# EAGLE design master_muhsin_v1 (EAGLE 7.1.0)
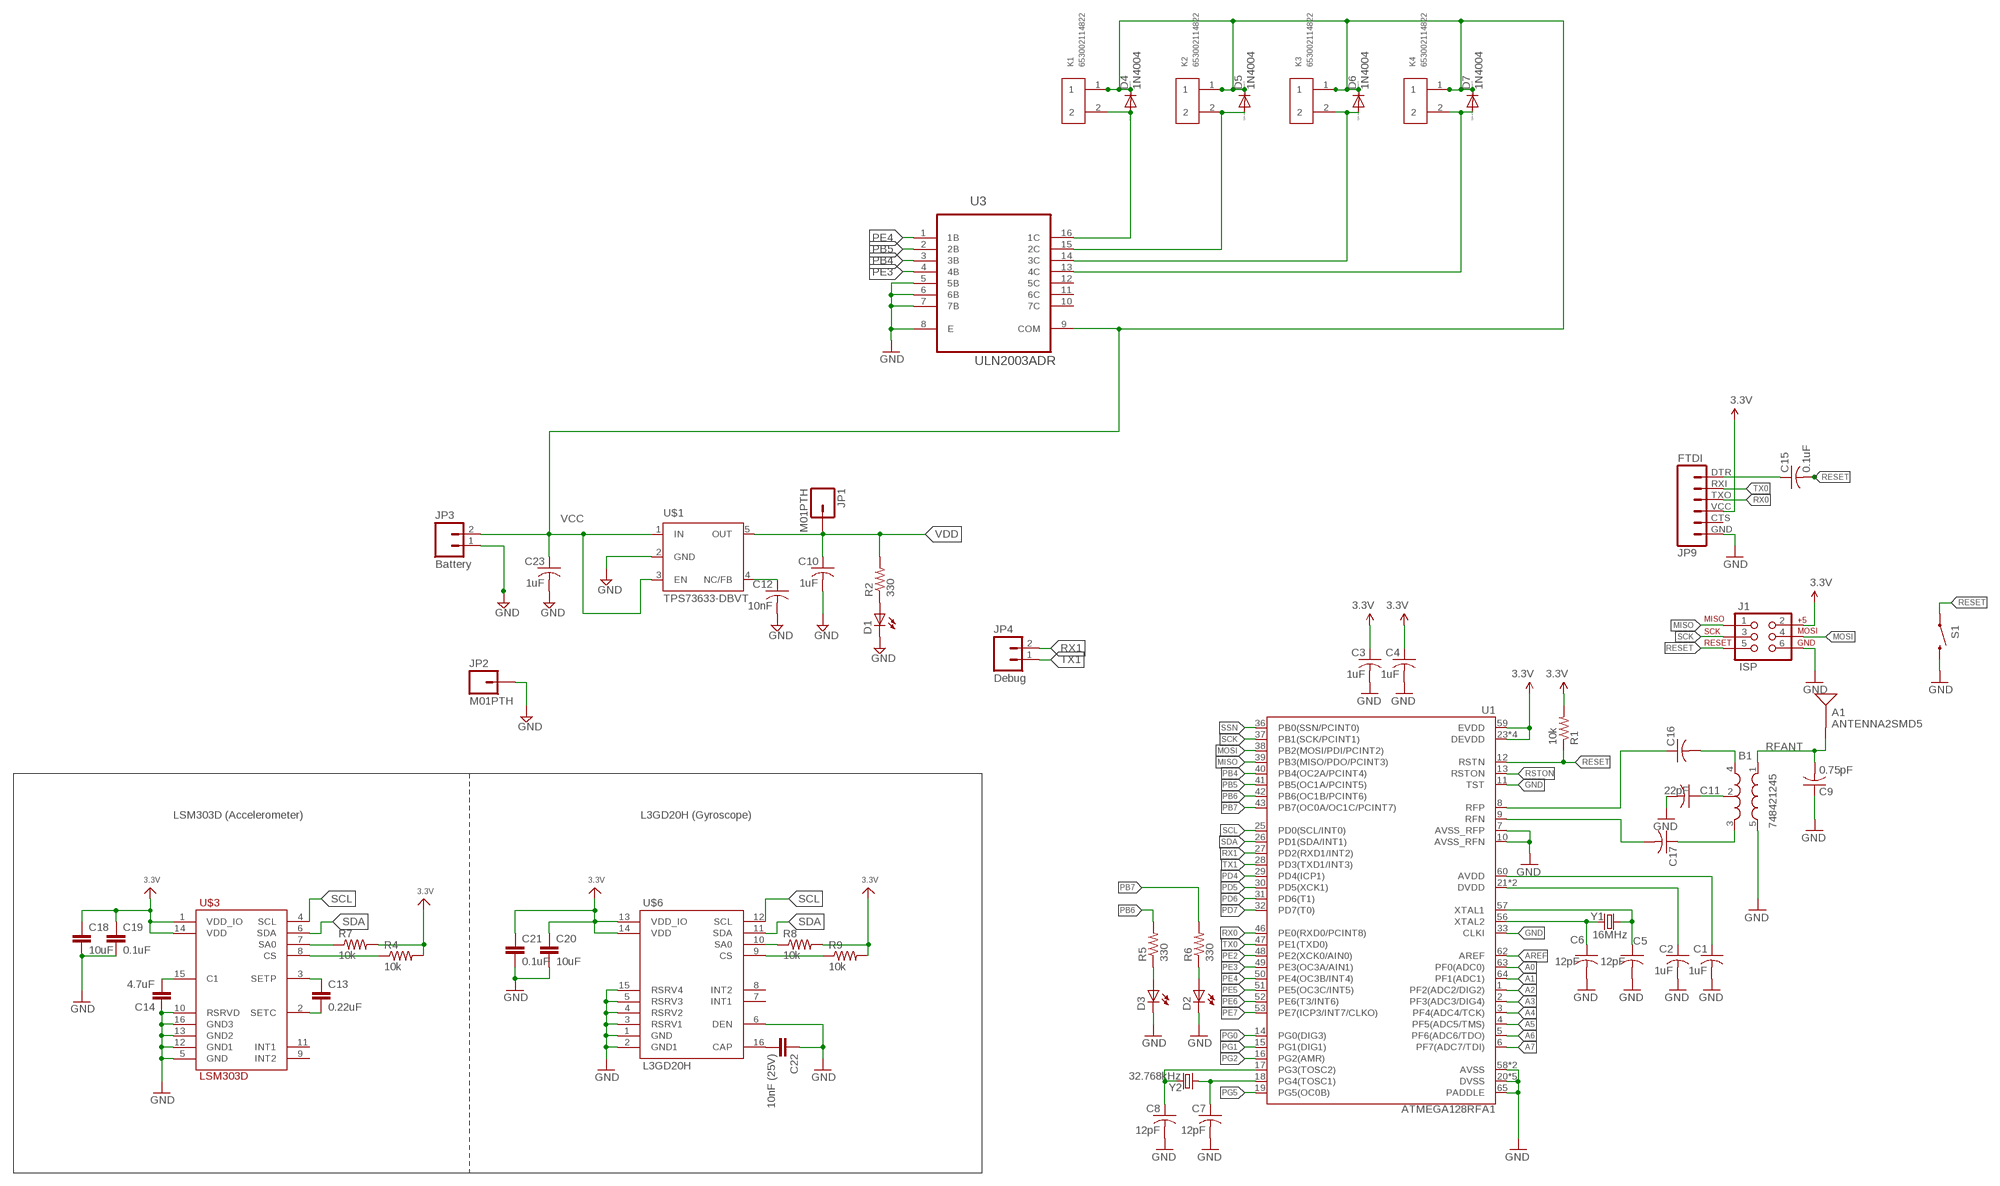
[diagram p0: schematic, sheet 1]

## Parts
A1  ANTENNA2SMD5  [ANTENNA-CHIP5]
B1  748421245  BALUN0805  [BALUN]
C1  1uF  C-USC0805  [C0805]
C2  1uF  C-USC0805  [C0805]
C3  1uF  C-USC0805  [C0805]
C4  1uF  C-USC0805  [C0805]
C5  12pF  C-USC0805  [C0805]
C6  12pF  C-USC0805  [C0805]
C7  12pF  C-USC0805  [C0805]
C8  12pF  C-USC0805  [C0805]
C9  0.75pF  C-USC0805  [C0805]
C10  1uF  C-USC0805  [C0805]
C11  22pF  C-USC0805  [C0805]
C12  10nF  C-USC0805  [C0805]
C13  0.22uF  CAP0805  [0805]
C14  4.7uF  CAP0805  [0805]
C15  0.1uF  C-USC0805  [C0805]
C16  C-USC0805  [C0805]
C17  C-USC0805  [C0805]
C18  10uF  CAP0805  [0805]
C19  0.1uF  CAP0805  [0805]
C20  10uF  CAP0805  [0805]
C21  0.1uF  CAP0805  [0805]
C22  10nF (25V)  CAP0805  [0805]
C23  1uF  C-USC0805  [C0805]
D1  LED5MM  [LED5MM]
D2  LED5MM  [LED5MM]
D3  LED5MM  [LED5MM]
D4  1N4004  [DO41-10]
D5  1N4004  [DO41-10]
D6  1N4004  [DO41-10]
D7  1N4004  [DO41-10]
J1  ISP  AVR_SPI_PRG_6NS  [2X3-NS]
JP1  M01PTH  [1X01]
JP2  M01PTH  [1X01]
JP3  Battery  M02PTH  [1X02]
JP4  Debug  M02PTH  [1X02]
JP9  FTDI  FTDI_BASICPTH  [FTDI_BASIC]
K1  653002114822  [653002114822]
K2  653002114822  [653002114822]
K3  653002114822  [653002114822]
K4  653002114822  [653002114822]
R1  10k  R-US_R0805  [R0805]
R2  330  R-US_R0805  [R0805]
R4  10k  RESISTOR0805-RES  [0805]
R5  330  R-US_R0805  [R0805]
R6  330  R-US_R0805  [R0805]
R7  10k  RESISTOR0805-RES  [0805]
R8  10k  RESISTOR0805-RES  [0805]
R9  10k  RESISTOR0805-RES  [0805]
S1  SWITCH-MOMENTARY-2SMD  [TACTILE_SWITCH_SMD]
U1  ATMEGA128RFA1  [QFN-64]
U3  ULN2003ADR  [SOIC127P600X175-16N]
U$1  TPS73633-DBVT  [SOT23-DBV]
U$3  LSM303D  [LGA16_3X3MM]
U$6  L3GD20H  [LGA16_3X3MM]
Y1  16MHz  CRYSTAL5X3  [CRYSTAL-SMD-5X3]
Y2  32.768kHz  CRYSTAL32-SMD  [CRYSTAL-32KHZ-SMD]

## Nets
3.3V: C3.1 C4.1 C18.1 C19.1 C20.1 C21.1 J1.2 JP9.VCC R1.2 R4.2 R7.2 R8.2 R9.2 U1.23(DEVDD) U1.34(DEVDD) U1.44(DEVDD) U1.54(DEVDD) U1.59(EVDD) U$3.1(VDD_IO) U$3.14(VDD) U$6.13(VDD_IO) U$6.14(VDD)
A0: U1.63(PF0(ADC0))
A1: U1.64(PF1(ADC1))
A2: U1.1(PF2(ADC2/DIG2))
A3: U1.2(PF3(ADC3/DIG4))
A4: U1.3(PF4(ADC4/TCK))
A5: U1.4(PF5(ADC5/TMS))
A6: U1.5(PF6(ADC6/TDO))
A7: U1.6(PF7(ADC7/TDI))
AREF: U1.62(AREF)
AVDD: C1.1 U1.60(AVDD)
DTR: C15.1 JP9.DTR
DVDD: C2.1 U1.21(DVDD) U1.22(DVDD)
GND: B1.5(GND) C1.2 C2.2 C3.2 C4.2 C5.2 C6.2 C7.2 C8.2 C9.1 C10.2 C11.2 C12.2 C14.1 C18.2 C19.2 C20.2 C21.2 C22.1 C23.2 D1.K(C) D2.K(C) D3.K(C) J1.6 JP2.1 JP3.1 JP9.GND S1.3 U1.7(AVSS_RFP) U1.10(AVSS_RFN) U1.11(TST) U1.20(DVSS) U1.24(DVSS) U1.33(CLKI) U1.35(DVSS) U1.45(DVSS) U1.55(DVSS) U1.58(AVSS) U1.61(AVSS) U1.65(PADDLE) U3.5(5B) U3.6(6B) U3.7(7B) U3.8(E) U$1.2(GND) U$3.5(GND) U$3.10(RSRVD) U$3.12(GND1) U$3.13(GND2) U$3.16(GND3) U$6.1(GND) U$6.2(GND1) U$6.3(RSRV1) U$6.4(RSRV2) U$6.5(RSRV3) U$6.6(DEN) U$6.15(RSRV4)
MISO: J1.1 U1.39(PB3(MISO/PDO/PCINT3))
MOSI: J1.4 U1.38(PB2(MOSI/PDI/PCINT2))
N$1: C12.1 U$1.4(NC/FB)
N$2: D1.A R2.1
N$3: C5.1 U1.57(XTAL1) Y1.3
N$4: C6.1 U1.56(XTAL2) Y1.1
N$5: C7.1 U1.18(PG4(TOSC1)) Y2.X1
N$6: C8.1 U1.17(PG3(TOSC2)) Y2.X2
N$7: B1.2(GND) C11.1
N$8: D3.A R5.1
N$9: C13.1 U$3.3(SETP)
N$10: B1.4(OUT1) C16.2
N$11: B1.3(OUT2) C17.1
N$12: C13.2 U$3.2(SETC)
N$13: D2.A R6.1
N$14: R4.1 U$3.8(CS)
N$15: R7.1 U$3.7(SA0)
N$16: C14.2 U$3.15(C1)
N$17: R8.1 U$6.10(SA0)
N$18: R9.1 U$6.9(CS)
N$19: C22.2 U$6.16(CAP)
N$29: D4.A K1.2 U3.16(1C)
N$30: D5.A K2.2 U3.15(2C)
N$31: D6.A K3.2 U3.14(3C)
N$32: D7.A K4.2 U3.13(4C)
PB4: U1.40(PB4(OC2A/PCINT4)) U3.3(3B)
PB5: U1.41(PB5(OC1A/PCINT5)) U3.2(2B)
PB6: R5.2 U1.42(PB6(OC1B/PCINT6))
PB7: R6.2 U1.43(PB7(OC0A/OC1C/PCINT7))
PD4: U1.29(PD4(ICP1))
PD5: U1.30(PD5(XCK1))
PD6: U1.31(PD6(T1))
PD7: U1.32(PD7(T0))
PE2: U1.48(PE2(XCK0/AIN0))
PE3: U1.49(PE3(OC3A/AIN1)) U3.4(4B)
PE4: U1.50(PE4(OC3B/INT4)) U3.1(1B)
PE5: U1.51(PE5(OC3C/INT5))
PE6: U1.52(PE6(T3/INT6))
PE7: U1.53(PE7(ICP3/INT7/CLKO))
PG0: U1.14(PG0(DIG3))
PG1: U1.15(PG1(DIG1))
PG2: U1.16(PG2(AMR))
PG5: U1.19(PG5(OC0B))
RESET: C15.2 J1.5 R1.1 S1.1 U1.12(RSTN)
RFANT [RFSIG]: A1.FEED(SIGNAL) B1.1(IN) C9.2
RFN: C17.2 U1.9(RFN)
RFP: C16.1 U1.8(RFP)
RSTON: U1.13(RSTON)
RX0: JP9.TXO U1.46(PE0(RXD0/PCINT8))
RX1: JP4.2 U1.27(PD2(RXD1/INT2))
SCK: J1.3 U1.37(PB1(SCK/PCINT1))
SCL: U1.25(PD0(SCL/INT0)) U$3.4(SCL) U$6.12(SCL)
SDA: U1.26(PD1(SDA/INT1)) U$3.6(SDA) U$6.11(SDA)
SSN: U1.36(PB0(SSN/PCINT0))
TX0: JP9.RXI U1.47(PE1(TXD0))
TX1: JP4.1 U1.28(PD3(TXD1/INT3))
VCC: C23.1 D4.C D5.C D6.C D7.C JP3.2 K1.1 K2.1 K3.1 K4.1 U3.9(COM) U$1.1(IN) U$1.3(EN)
VDD: C10.1 JP1.1 R2.2 U$1.5(OUT)
Unconnected: JP9.CTS U3.10(7C) U3.11(6C) U3.12(5C) U$3.9(INT2) U$3.11(INT1) U$6.7(INT1) U$6.8(INT2)

## Notes on the sheet
- LSM303D (Accelerometer) | L3GD20H (Gyroscope)

## Library data of the parts
A1 = SparkFun-RF:ANTENNA2: Chip antenna Single endded antenna. Common with smaller chip antennas. CHIP4 package is the GPS Chip Antenna SKU: GPS-08418. CHIP5 package is 2.4GHz chip antenna SKU: WRL-00144.
B1 = SparkFun-RF:BALUN: 0805 footprint balun- Ember 351/357
C1-C12 C15-C17 C23 = resistor:C-US: CAPACITOR, American symbol
C13 C14 C18-C22 = SparkFun-Capacitors:CAP: Capacitor Standard 0603 ceramic capacitor, and 0.1" leaded capacitor.
D1-D3 = Components:LED: LED OSRAM: - CHIPLED LG R971, LG N971, LY N971, LG Q971, LY Q971, LO R971, LY R971 LH N974, LH R974 LS Q976, LO Q976, LY Q976 LO Q996 - Hyper CHIPLED LW Q18S LB Q993, LB Q99A, LB R99A - SideLED LS A670, LO A670, LY A670, LG A670, LP A670 LB A673, LV A673, LT A673, LW A673 LH A674 LY A675 LS A676, LA A676, LO A676, LY A676, LW A676 LS A679, LY A679, LG A679 - Hyper Micro SIDELED® LS Y876, LA Y876, LO Y876, LY Y876 LT Y87S - SmartLED LW L88C, LW L88S LB L89C, LB L89S, LG L890 LS L89K, LO L89K, LY L89K LS L896, LA L896, LO L896, LY L896 - TOPLED LS T670, LO T670, LY T670, LG T670, LP T670 LSG T670, LSP T670, LSY T670, LOP T670, LYG T670 LG T671, LOG T671, LSG T671 LB T673, LV T673, LT T673, LW T673 LH T674 LS T676, LA T676, LO T676, LY T676, LB T676, LH T676, LSB T676, LW T676 LB T67C, LV T67C, LT T67C, LS T67K, LO T67K, LY T67K, LW E67C LS E67B, LA E67B, LO E67B, LY E67B, LB E67C, LV E67C, LT E67C LW T67C LS T679, LY T679, LG T679 LS T770, LO T770, LY T770, LG T770, LP T770 LB T773, LV T773, LT T773, LW T773 LH T774 LS E675, LA E675, LY E675, LS T675 LS T776, LA T776, LO T776, LY T776, LB T776 LHGB T686 LT T68C, LB T68C - Hyper Mini TOPLED® LB M676 - Mini TOPLED Santana® LG M470 LS M47K, LO M47K, LY M47K Source: http://www.osram.convergy.de/
D4-D7 = diode:1N4004: DIODE general purpose rectifier, 1 A; MF: NTE ELECTRONICS; MPN: 1N4004; OC_FARNELL: 2295710
J1 = SparkFun-Connectors:AVR_SPI_PRG_6: AVR ISP 6 Pin This is the reduced ISP connector for AVR programming. Common on Arduino. This footprint will take up less PCB space and can be used with a 10-pin to 6-pin adapter such as SKU: BOB-08508
JP1 JP2 = SparkFun:M01: Header 1 Standard 1-pin 0.1" header. Use with straight break away headers (SKU : PRT-00116), right angle break away headers (PRT-00553), swiss pins (PRT-00743), machine pins (PRT-00117), and female headers (PRT-00115).
JP3 JP4 = SparkFun:M02: Header 2 Standard 2-pin 0.1" header. Use with straight break away headers (SKU : PRT-00116), right angle break away headers (PRT-00553), swiss pins (PRT-00743), machine pins (PRT-00117), and female headers (PRT-00115). Molex polarized connector foot print use with SKU : PRT-08233 with associated crimp pins and housings.
JP9 = SparkFun-Connectors:FTDI_BASIC: FTDI Basic header with labels
K1-K4 = Wuerth_Elektronik_eiCan_Wire_to_Board_Connectors:653002114822: WR-WTB 1.25mm Male Vertical Shrouded Header, 2 Pins=>Code : Con_WTB_1.25_PCB_THT_653002114822 <http://katalog.we-online.de/media/thumbs2/eican/thb_Con_WTB_1.25_PCB_THT_6530xx114822_pf2.jpg> Details see: http://katalog.we-online.de/en/em/653_0xx_114_822 Created 2014-06-06, Karrer Zheng 2014 (C) Würth Elektronik; OC_FARNELL: unknown
R1 R2 R5 R6 = resistor:R-US_: RESISTOR, American symbol
R4 R7-R9 = SparkFun-Passives:RESISTOR: Resistor Basic schematic elements and footprints for 0603, 1206, and PTH resistors.
S1 = SparkFun-Electromechanical:SWITCH-MOMENTARY-2: Various NO switches- pushbuttons, reed, etc
U1 = SparkFun-DigitalIC:ATMEGA128RFA1: ATmega128RFA1 8-bit AVR Microcontroller with Low Power 2.4GHz Transceiver for ZigBee and IEEE 802.15.4
U3 = Texas Instruments_By_element14_Batch_1:ULN2003ADR: 8-BIT SHIFT REGISTERS WITH 3-STATE OUTPUT REGISTERS; MPN: ULN2003ADR; OC_FARNELL: 1470513; OC_NEWARK: 77C3560; PACKAGE: SOIC-16; SUPPLIER: TEXAS INSTRUMENTS
U$1 = Power:TPS73633-DBVT
U$3 = IMU_parts:LSM303D
U$6 = IMU_parts:L3GD20H
Y1 Y2 = SparkFun-FreqCtrl:CRYSTAL: Various standard crystals. Proven footprints. Spark Fun Electronics SKU : COM-00534

## Net classes
1 RFSIG: width 0.457 mm, clearance 0.205 mm to class 0, clearance 0.205 mm

## Board
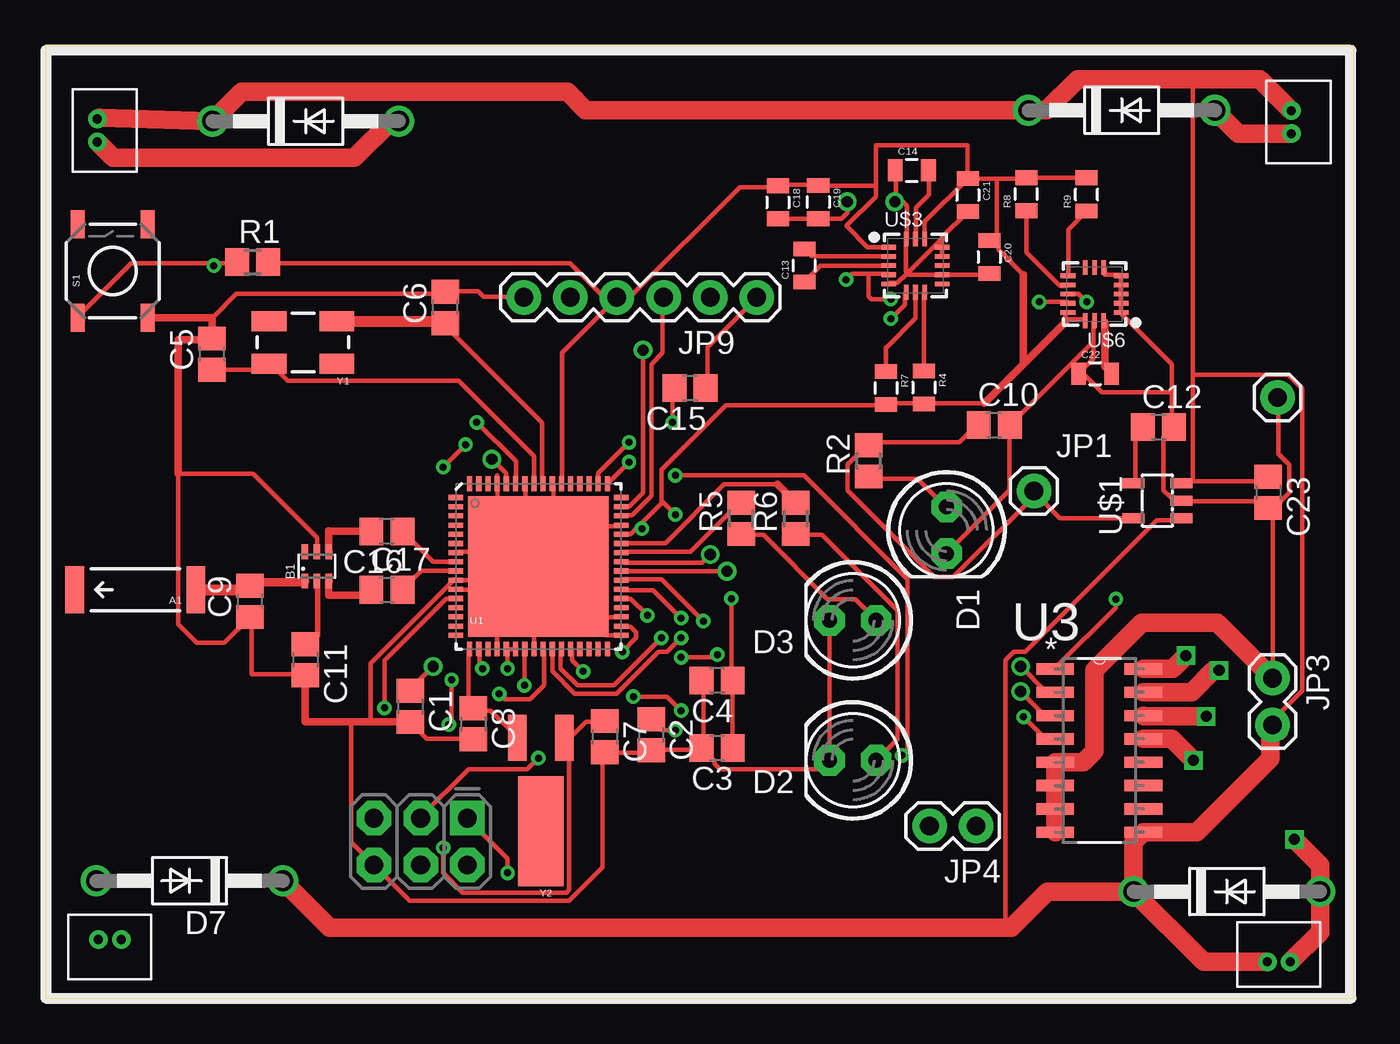
[diagram p1: board, top side]
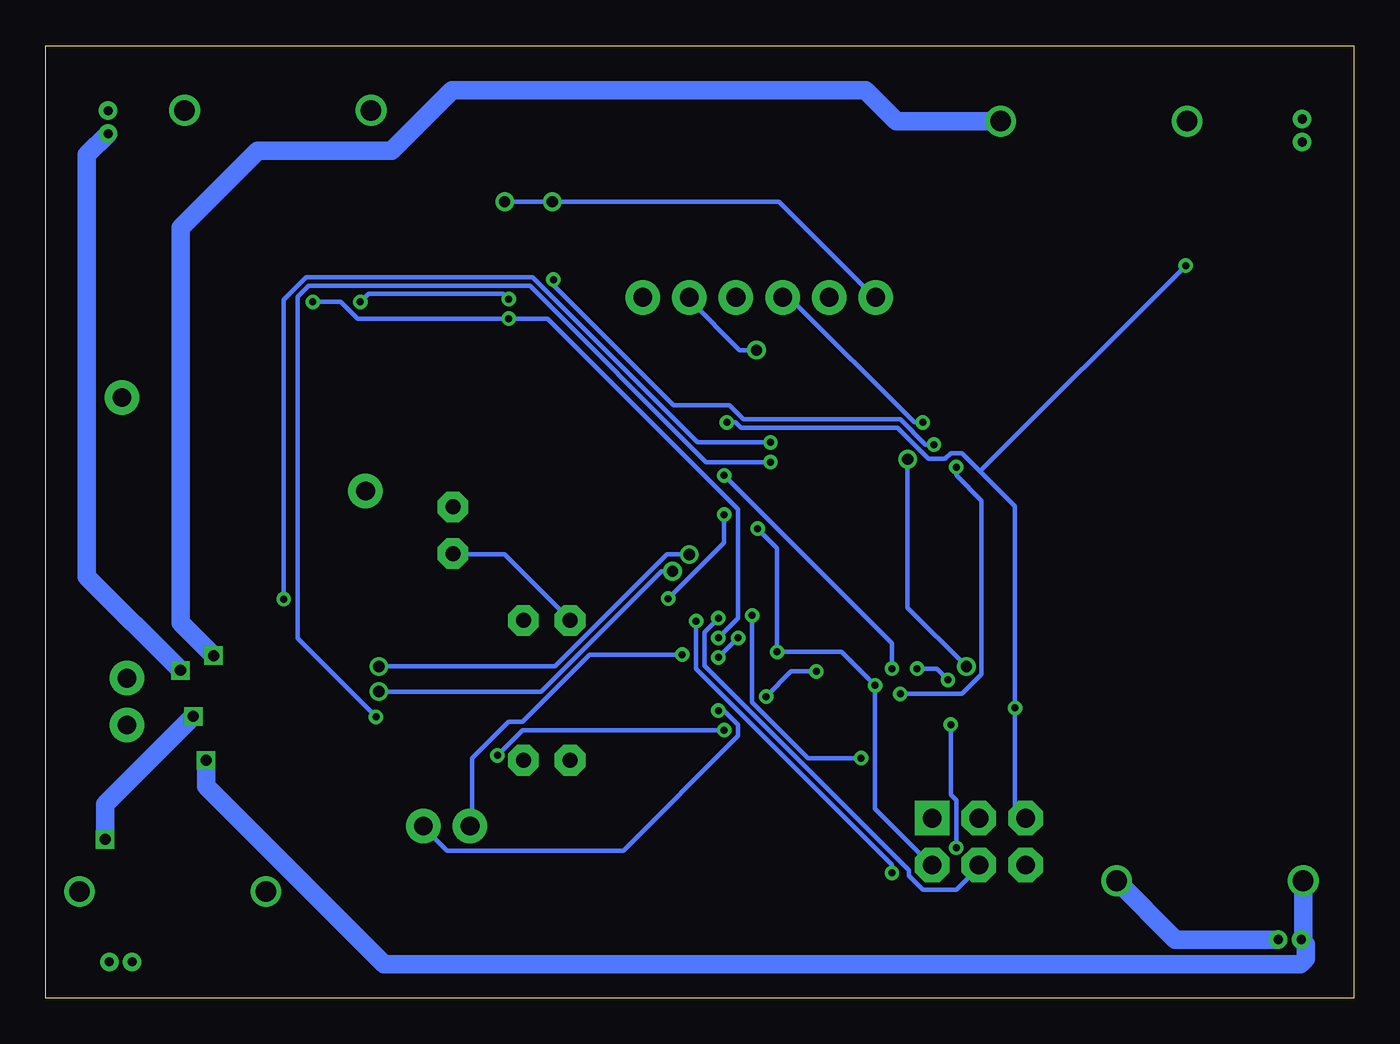
[diagram p2: board, bottom side, seen from below]

Size 71.23 x 51.84 mm. Coordinates in mm from the lower left corner, seen from the top.
Outline: 0,0 71.23,0 71.23,51.84 0,51.84 0,0
Copper layers (1*16): Top 0.035559375mm / dielectric 1.501140625mm / Bottom 0.035559375mm
Design rules "4pcb-33board": minimum track width 10mil, minimum drill 15mil, track to track 6mil, track to pad 6mil, pad to pad 6mil, via to via 6mil, smd to smd 6mil, copper to edge 10mil, drill to drill 10mil, minimum pad ring 10mil, minimum via ring 8mil, stop-mask expansion 4mil, vias tented up to drill 0mil, thermal gap 10mil

### Footprints (pad centres in the part's own frame; a part is rotated, then mirrored left to right if it is on the bottom)
ANTENNA-CHIP5 = smd 1.016 x 2.54: FEED -3.302,0; NC 3.302,0
BALUN = smd 0.35 x 0.8: 1 -0.65,-0.8; 2 0,-0.8; 3 0.65,-0.8; 4 0.65,0.8; 5 0,0.8; 6 -0.65,0.8
C0805 = smd 1.3 x 1.5: 1 -0.85,0; 2 0.85,0
0805 = smd 0.8 x 1.2: 1 -0.9,0; 2 0.9,0
LED5MM = drill 0.813 pad 1.676 octagon: A -1.27,0; K 1.27,0
DO41-10 = drill 1.118: A 5.08,0; C -5.08,0
2X3-NS = drill 1.016 pad 1.88 square: 1 -2.54,-1.27 | drill 1.016 pad 1.88 octagon: 2 -2.54,1.27; 3 0,-1.27; 4 0,1.27; 5 2.54,-1.27; 6 2.54,1.27
1X01 = drill 1.016 pad 1.88: 1 0,0
1X02 = drill 1.016 pad 1.88: 1 0,0; 2 2.54,0
FTDI_BASIC = drill 1.016 pad 1.88: CTS 10.16,0; DTR 0,0; GND 12.7,0; RXI 2.54,0; TXO 5.08,0; VCC 7.62,0
653002114822 = drill 0.5: 1 0.625,0; 2 -0.625,0
R0805 = smd 1.3 x 1.5: 1 -0.85,0; 2 0.85,0
TACTILE_SWITCH_SMD = smd 1.524 x 0.762: 1 -2.54,1.905; 2 2.54,1.905; 3 -2.54,-1.905; 4 2.54,-1.905
QFN-64 = smd 0.8 x 0.28: 1 -4.5,3.75; 2 -4.5,3.25; 3 -4.5,2.75; 4 -4.5,2.25; 5 -4.5,1.75; 6 -4.5,1.25; 7 -4.5,0.75; 8 -4.5,0.25; 9 -4.5,-0.25; 10 -4.5,-0.75; 11 -4.5,-1.25; 12 -4.5,-1.75; 13 -4.5,-2.25; 14 -4.5,-2.75; 15 -4.5,-3.25; 16 -4.5,-3.75; 33 4.5,-3.75; 34 4.5,-3.25; 35 4.5,-2.75; 36 4.5,-2.25; 37 4.5,-1.75; 38 4.5,-1.25; 39 4.5,-0.75; 40 4.5,-0.25; 41 4.5,0.25; 42 4.5,0.75; 43 4.5,1.25; 44 4.5,1.75; 45 4.5,2.25; 46 4.5,2.75; 47 4.5,3.25; 48 4.5,3.75 | smd 0.28 x 0.8: 17 -3.75,-4.5; 18 -3.25,-4.5; 19 -2.75,-4.5; 20 -2.25,-4.5; 21 -1.75,-4.5; 22 -1.25,-4.5; 23 -0.75,-4.5; 24 -0.25,-4.5; 25 0.25,-4.5; 26 0.75,-4.5; 27 1.25,-4.5; 28 1.75,-4.5; 29 2.25,-4.5; 30 2.75,-4.5; 31 3.25,-4.5; 32 3.75,-4.5; 49 3.75,4.5; 50 3.25,4.5; 51 2.75,4.5; 52 2.25,4.5; 53 1.75,4.5; 54 1.25,4.5; 55 0.75,4.5; 56 0.25,4.5; 57 -0.25,4.5; 58 -0.75,4.5; 59 -1.25,4.5; 60 -1.75,4.5; 61 -2.25,4.5; 62 -2.75,4.5; 63 -3.25,4.5; 64 -3.75,4.5 | smd 7.65 x 7.65: 65 0,0
SOIC127P600X175-16N = smd 2.057 x 0.61: 1 -4.801,8.89; 2 -4.801,7.62; 3 -4.801,6.35; 4 -4.801,5.08; 5 -4.801,3.81; 6 -4.801,2.54; 7 -4.801,1.27; 8 -4.801,0; 9 0,0; 10 0,1.27; 11 0,2.54; 12 0,3.81; 13 0,5.08; 14 0,6.35; 15 0,7.62; 16 0,8.89
SOT23-DBV = smd 0.55 x 1.2: 1 -0.95,-1.3; 2 0,-1.3; 3 0.95,-1.3; 4 0.95,1.3; 5 -0.95,1.3
LGA16_3X3MM = smd 0.8 x 0.25: 1 -1.45,1; 2 -1.45,0.5; 3 -1.45,0; 4 -1.45,-0.5; 5 -1.45,-1; 9 1.45,-1; 10 1.45,-0.5; 11 1.45,0; 12 1.45,0.5; 13 1.45,1 | smd 0.25 x 0.8: 6 -0.5,-1.45; 7 0,-1.45; 8 0.5,-1.45; 14 0.5,1.45; 15 0,1.45; 16 -0.5,1.45
CRYSTAL-SMD-5X3 = smd 1.9 x 1.1: 1 -1.85,-1.15; 2 1.85,-1.15; 3 1.85,1.15; 4 -1.85,1.15
CRYSTAL-32KHZ-SMD = smd 2.5 x 6: SHEILD 0,5.08 | smd 1 x 2.5: X1 -1.27,0; X2 1.27,0

### Placement (x,y rotation side)
A1  4.87,22.23 180 top
B1  14.77,23.5 0 top
C1  19.85,15.88 270 top
C2  32.96,14.33 270 top
C3  36.56,13.6 180 top
C4  36.56,17.29 180 top
C5  9.05,35.06 90 top
C6  21.75,37.6 90 top
C7  30.44,14.23 270 top
C8  23.28,14.93 270 top
C9  11.12,21.6 90 top
C10  51.66,31.2 0 top
C11  14.13,18.42 270 top
C12  60.6,31.09 0 top
C13  41.31,39.89 90 top
C14  47.16,45.07 0 top
C15  35.09,33.2 180 top
C16  18.58,25.41 180 top
C17  18.58,22.23 0 top
C18  39.87,43.33 270 top
C19  42.07,43.33 270 top
C20  51.38,40.34 270 top
C21  50.22,43.72 270 top
C22  57.15,34 0 top
C23  66.58,27.53 270 top
D1  49.06,25.47 270 top
D2  43.95,12.94 180 top
D3  43.95,20.56 180 top
D4  14.15,47.74 0 top
D5  58.6,48.34 0 top
D6  64.32,5.8 0 top
D7  7.82,6.39 180 top
J1  20.41,8.52 180 top
JP1  53.81,27.6 0 top
JP2  67.08,32.7 0 top
JP3  66.82,17.41 270 top
JP4  50.67,9.37 180 top
JP9  38.72,38.15 180 top
K1  2.8,47.24 90 top
K2  67.84,47.69 90 top
K3  67.15,1.97 180 top
K4  3.48,3.19 0 top
R1  11.26,40.08 0 top
R2  44.81,29.25 90 top
R4  47.82,33.24 270 top
R5  37.87,26.12 90 top
R6  40.85,26.12 90 top
R7  45.76,33.21 270 top
R8  53.4,43.77 90 top
R9  56.67,43.76 90 top
S1  3.64,39.58 90 top
U1  26.83,23.5 0 top
U3  59.78,9.03 0 top
U$1  60.54,27.08 90 top
U$3  47.36,39.88 0 top
U$6  57.11,38.33 180 top
Y1  14,35.69 180 top
Y2  26.96,14.17 180 top

### Tracks (layer width: path | path; a pad name or v marks a point on that pad's centre or on a via)
3.3V  (via drill 0.38)
  Top 0.254: U$3.14 47.86,42.26 C21.1 | U$3.1 44.76,40.88 43.6,42.04 45.2,43.64 45.2,44.23 | C21.1 50.2,44.62 50.2,46.44 45.2,46.44 45.2,44.23 | C21.1 51.8,44.62 | 51.8,44.62 53.4,44.62 R8.2 R9.2 | 51.8,44.62 51.8,41.24 C20.1 51.88,41.22 51.88,40.77 53.25,39.39 | 45.2,44.23 C19.1 41.97,44.27 39.99,44.27 C18.1 39.78,44.15 37.8,44.15 31.85,38.21 31.24,38.21 JP9.VCC | 55.54,36.8 55.54,36.95 | 55.54,36.95 55.54,37.26 U$6.13 | 51.12,32.38 47.92,32.38 R4.2 47.76,32.38 45.78,32.38 R7.2 45.72,32.26 37.03,32.26 33.53,28.76 33.53,27.08 | 53.25,34.67 53.33,34.59 | U1.54 28.1,28.12 28.1,35.13 31,38.02 JP9.VCC | R1.2 12.25,40 28.56,40 30.69,37.87 JP9.VCC | C3.1 37.4,13.64 37.4,17.14 C4.1 37.34,17.33 v37.34,21.75 | 55.54,36.95 56.6,36.95 U$6.14 | v26.06,17.02 26.06,18.85 U1.23 | v31.39,18.85 32.16,19.61 32.16,19.92 31.85,20.22 31.39,20.22 U1.34 | v23.47,31.35 25.6,29.21 25.6,28.15 U1.59 | 32.23,25.63 33.53,26.93 33.53,27.08 | 32.23,25.63 31.85,25.25 31.39,25.25 U1.44 | 33.53,27.08 v34.29,26.32 | v32.46,25.56 32.31,25.56 32.23,25.63
  Top 0.406: 51.12,32.38 53.33,34.59 55.54,36.8 | 53.25,34.67 53.25,39.39
  Bottom 0.254: J1.2 23.01,7.27 26.06,10.32 v26.06,17.02 27.89,18.85 v31.39,18.85 31.39,24.49 v32.46,25.56 | v23.47,31.35 23.93,31.35 30.63,38.05 31.09,38.05 JP9.VCC | v37.34,21.75 34.29,24.8 v34.29,26.32
AVDD  (via drill 0.61)
  Top 0.254: v24.29,29.34 25.06,28.57 25.06,28.12 U1.60 | v21.09,18.06 19.87,16.84 C1.1
  Bottom 0.254: v24.29,29.34 24.29,21.26 v21.09,18.06
DTR
  Top 0.254: C15.1 36.03,33.3 36.03,35.43 38.62,38.02 JP9.DTR
DVDD  (via drill 0.38)
  Top 0.254: U1.22 U1.21 25.15,18.85 v25.15,17.94 | v34.29,28.45 41.3,28.45 46.94,22.81 46.94,13.52 v46.63,13.21 | v34.29,14.58 33.53,14.58 33.07,15.04 C2.1
  Bottom 0.254: v25.15,17.94 25.15,19.31 v34.29,28.45 | v46.63,13.21 45.26,14.58 v34.29,14.58
GND  (via drill 0.61)
  Top 0.254: 46.31,43.73 46.3,43.74 46.3,45.04 C14.1 | 46.31,43.73 46.9,43.14 46.9,41.34 U$3.16 46.85,41.22 46.85,39.55 46.93,39.47 | U$3.12 U$3.13 48.81,41.37 | 48.81,41.37 48.81,41.41 C21.2 | C18.2 C19.2 42.12,42.44 43.34,42.44 43.65,42.75 v43.65,43.36 | U1.33 30.49,19.75 30.4,19.84 30.4,20.64 30.3,20.74 | 30.3,20.74 U1.35 | U1.24 26.58,19.84 | U1.20 24.58,19.82 | 24.58,19.82 24.6,19.84 | U1.65 26.6,23.5 26.6,20.74 | 26.6,20.74 26.6,19.94 26.58,19.92 26.58,19.84 | 30.3,20.74 26.6,20.74 | 24.6,19.84 24.6,19.82 24.58,19.82 | 24.6,19.84 26.58,19.84 | 24.6,19.84 24.6,22.24 23.6,22.24 | 23.6,22.24 U1.11 | 23.6,22.24 23.09,22.75 U1.10 22.25,22.81 17.68,18.24 17.68,15.03 | 24.58,28.46 U1.61 24.6,27.96 24.6,26.13 | C11.2 14.13,17.64 11.2,17.64 11.2,20.75 C9.1 9.71,19.34 8.2,19.34 7.2,20.34 7.2,28.54 11.3,28.54 14.77,25.07 B1.5 | 9.05,37.04 9.15,37.12 10.37,38.34 21.65,38.34 C6.2 21.86,38.48 23.53,38.48 23.84,38.17 25.97,38.17 JP9.GND | U$6.6 57.67,39.7 57.67,39.39 58.43,39.39 U$6.5 U$6.4 U$6.3 U$6.2 U$6.1 58.58,37.26 61.33,34.52 61.33,32.99 | C20.2 51.27,39.39 48.83,39.39 U$3.10 48.68,39.39 47,39.39 46.93,39.47 | v46.24,43.36 46.24,43.66 46.31,43.73 | 27.72,26.21 27.65,26.29 27.65,27.96 U1.55 | 27.72,26.21 28.26,25.68 31.3,25.68 U1.45 | U1.7 22.46,24.31 24.29,24.31 25.06,23.54 26.58,23.54 U1.65 | 24.6,26.13 24.6,24.15 U1.65 | 25.97,26.44 25.67,26.13 24.6,26.13 | 25.97,26.44 26.12,26.59 26.12,27.96 U1.58 | 24.6,26.13 U1.65 | 25.97,26.44 26.28,26.13 27.65,26.13 27.72,26.21 | 25.97,26.44 U1.65 | 46.93,39.47 48.83,41.37 48.81,41.37 | 46.93,39.47 46.39,38.94 45.93,38.94 U$3.5 | 57.06,35.74 57.06,34.82 56.3,34.06 C22.1 56.45,34.06 57.52,32.99 61.33,32.99
  Top 0.254: 57.06,35.74 57.06,36.8 U$6.15 | 57.06,35.74 52.64,31.32 C10.2 52.49,31.16 52.49,27.66 49.13,24.31 D1.K | C23.2 66.51,26.74 66.2,27.05 61.94,27.05 U$1.2 61.78,27.2 61.33,27.2 60.87,27.66 60.87,30.55 61.33,31.01 C12.2 61.33,31.16 61.33,32.99 | JP3.1 66.81,17.45 66.81,26.44 66.66,26.59 C23.2 | JP2.1 67.12,32.69 67.12,29.64 67.73,29.03 67.73,27.51 66.81,26.59 C23.2 | C3.2 35.66,13.52 33.07,13.52 C2.2 32.92,13.37 30.48,13.37 C7.2 30.33,13.37 30.33,7.12 28.5,5.29 19.81,5.29 17.98,7.12 J1.6 17.83,7.27 16.61,8.49 16.61,15.03 | C4.2 35.81,17.18 35.81,13.67 C3.2 | D3.K 42.67,20.53 42.67,13.06 D2.K 42.67,12.91 42.22,12.45 36.73,12.45 36.42,12.76 36.42,12.91 35.81,13.52 C3.2 | C8.2 23.17,14.13 20.73,14.13 19.96,14.89 C1.2
  Top 0.406: C1.2 17.68,15.03 16.61,15.03 14.13,15.03 C11.2 | 7.2,28.54 7.2,35.84 9.05,35.84 C5.2 9.05,37.04 S1.3
  Top 1.016: U3.8 U3.7 U3.6 U3.5 56.5,12.84 57.1,13.44 57.1,17.84 59.7,20.44 63.79,20.44 JP3.1
  Bottom 0.254: v46.24,43.36 v43.65,43.36 31.3,43.36 26.12,38.17 JP9.GND | D1.K 48.98,24.15 46.24,24.15 42.73,20.65 D3.K
MISO  (via drill 0.38)
  Top 0.254: v35.81,20.53 33.53,22.81 31.39,22.81 U1.39 | v25.15,6.81 25.15,7.57 23.01,9.71 J1.1
  Bottom 0.254: v35.81,20.53 35.81,17.94 25.15,7.27 v25.15,6.81
MOSI  (via drill 0.38)
  Top 0.254: v34.59,20.68 33.07,22.21 31.39,22.21 U1.38
  Bottom 0.254: v34.59,20.68 35.36,19.92 35.36,18.09 24.23,6.97 24.23,6.66 23.47,5.9 21.64,5.9 20.42,7.12 J1.4
N$1
  Top 0.254: 59.35,30.71 59.65,31.01 C12.1 59.35,30.71 | 59.35,30.71 59.35,28.12 U$1.4
N$2
  Top 0.254: R2.1 44.87,28.27 47.46,28.27 48.98,26.74 D1.A
N$3
  Top 0.254: U1.57 26.58,28.12 26.58,29.49 22.46,33.6 13.17,33.6 12.25,34.52 Y1.3 12.41,34.21 C5.1
N$4
  Top 0.254: U1.56 27.04,28.12 27.04,31.32 21.86,36.5 C6.1
  Top 0.61: Y1.1 21.75,36.84 C6.1
N$5  (via drill 0.38)
  Top 0.254: v23.77,17.94 23.62,18.09 23.62,18.85 U1.18 | v22.1,17.33 22.1,15.04 v21.95,14.89 | v21.64,8.18 21.64,6.81 22.71,5.75 28.35,5.75 28.5,5.9 28.5,13.97 28.35,14.13 Y2.X1 28.5,14.13 29.41,15.04 30.33,15.04 C7.1
  Bottom 0.254: v23.77,17.94 22.71,17.94 v22.1,17.33 | v21.95,14.89 21.95,11.08 21.64,10.78 v21.64,8.18
N$6
  Top 0.254: U1.17 23.01,18.85 23.01,15.96 23.17,15.8 C8.1 23.32,15.65 24.23,15.65 25.6,14.28 Y2.X2
N$7
  Top 0.305: B1.2 14.8,22.7 14.8,19.74 14.13,19.74 C11.1
N$8
  Top 0.254: R5.1 38.01,25.22 39.08,25.22 42.58,21.71 44.11,21.71 45.17,20.65 D3.A
N$9
  Top 0.254: U$3.3 42.2,39.88 C13.1
N$10
  Top 0.406: B1.4 15.4,24.32 15.4,25.44 15.43,25.41 C16.2
N$11
  Top 0.406: B1.3 15.4,22.69 15.4,21.94 17.73,21.94 C17.1
N$12
  Top 0.254: U$3.2 41.72,40.38 C13.2
N$13
  Top 0.254: R6.1 40.91,25.22 42.28,25.22 46.39,21.11 46.39,14.09 45.33,13.03 D2.A
N$14
  Top 0.254: U$3.8 47.82,38.43 R4.1
N$15
  Top 0.254: U$3.7 47.36,37 45.8,35.44 45.76,35.44 R7.1
N$16
  Top 0.254: U$3.15 47.4,41.34 47.4,43.04 48.1,43.74 48.1,45.04 C14.2
N$17
  Top 0.254: U$6.10 55.54,38.78 55.23,38.78 53.4,40.61 53.4,42.75 R8.1
N$18
  Top 0.254: U$6.9 55.69,39.39 55.69,41.83 56.6,42.75 R9.1
N$19
  Top 0.254: 57.67,34.36 57.97,34.06 C22.2 | 57.67,36.8 U$6.16
  Top 0.406: 57.67,34.36 57.67,36.8
N$29  (via drill 0.6)
  Top 1.016: U3.16 61.38,17.92 v62.1,18.64 | K1.2 3.68,45.74 16.8,45.74 18.8,47.74 D4.A
  Bottom 1.016: v62.1,18.64 63.9,20.44 63.9,41.94 59.7,46.14 52.4,46.14 49.1,49.44 26.6,49.44 24.9,47.74 D4.A
N$30  (via drill 0.6)
  Top 1.016: U3.15 62.41,16.65 63.6,17.84 v63.9,17.84 | D5.A 64.95,47.07 K2.2
  Bottom 1.016: K2.2 69,45.9 69,22.94 v63.9,17.84
N$31  (via drill 0.6)
  Top 1.016: K3.2 69.4,3.59 D6.A 69.4,7.24 v68,8.64 | v63.2,15.34 59.81,15.34 U3.14
  Bottom 1.016: v68,8.64 68,10.54 v63.2,15.34
N$32  (via drill 0.6)
  Top 1.016: U3.13 61.33,14.11 v62.5,12.94
  Bottom 1.016: v62.5,12.94 62.5,11.54 52.8,1.84 2.9,1.84 2.6,2.14 2.6,2.93 K4.2 2.74,3.29 D7.A
PB4  (via drill 0.61)
  Top 0.254: v37.09,23.24 31.46,23.24 U1.40 | v53.1,16.69 54.32,15.47 54.93,15.47 U3.3
  Bottom 0.254: v37.09,23.24 37.7,23.24 44.26,16.69 v53.1,16.69
PB5  (via drill 0.61)
  Top 0.254: v36.18,24.15 35.72,23.7 31.46,23.7 U1.41 | v53.1,18.06 54.47,16.69 54.93,16.69 U3.2
  Bottom 0.254: v36.18,24.15 37.4,24.15 43.5,18.06 v53.1,18.06
PB6
  Top 0.254: U1.42 31.46,24.31 35.11,24.31 37.86,27.05 R5.2
PB7
  Top 0.254: 39.84,27.96 36.94,27.96 33.74,24.76 31.46,24.76 U1.43 | 40.75,27.05 R6.2
  Top 0.406: 40.75,27.05 39.84,27.96
PE3  (via drill 0.38)
  Top 0.254: v31.76,29.18 30.69,28.12 U1.49 | v53.25,15.31 54.32,14.25 54.93,14.25 U3.4
  Bottom 0.254: v31.76,29.18 35.27,29.18 44.87,38.78 56.91,38.78 57.52,38.17 57.52,19.58 v53.25,15.31
PE4  (via drill 0.38)
  Top 0.254: v31.76,30.25 30.09,28.57 30.09,28.12 U1.50 | v58.28,21.71 58.28,21.26 55.08,18.06 U3.1
  Bottom 0.254: v31.76,30.25 35.72,30.25 44.72,39.24 57.06,39.24 58.28,38.02 v58.28,21.71
RESET  (via drill 0.38)
  Top 0.254: 9.14,40 4.63,40 1.74,37.11 S1.1 | 9.14,40 10.27,40 R1.1 | v18.44,15.8 18.44,18.39 21.79,21.75 22.25,21.75 U1.12 | v34.14,31.35 34.14,33.18 C15.2 | v9.14,39.88 9.14,40
  Bottom 0.254: J1.5 17.98,9.86 18.44,10.32 v18.44,15.8 18.44,26.78 20.35,28.68 | v34.14,31.35 33.68,31.35 33.38,31.04 24.84,31.04 23.17,29.37 22.25,29.37 21.95,29.67 21.34,29.67 20.35,28.68 | 20.35,28.68 v9.14,39.88
RFANT
  Top 0.457: B1.1 14.03,22.64 11.29,22.64 C9.2
  Top 0.61: A1.FEED 11.12,22.23 C9.2
RFN
  Top 0.254: U1.9 20.45,23.25 C17.2
RFP
  Top 0.254: U1.8 21.08,23.75 C16.1
RX0
  Top 0.254: U1.46 31.46,26.29 31.91,26.29 32.98,27.35 32.98,34.52 33.59,35.13 33.59,38.02 JP9.TXO
RX1  (via drill 0.38)
  Top 0.254: v33.53,19.61 30.94,17.02 28.96,17.02 28.04,17.94 28.04,18.85 U1.27 | v34.59,18.55 36.42,18.55 v36.58,18.7
  Bottom 0.254: v34.59,18.55 v33.53,19.61 | v36.58,18.7 41.61,18.7 45.26,15.04 46.02,15.04 48.01,13.06 48.01,9.4 JP4.2
SCK  (via drill 0.38)
  Top 0.254: v32.77,20.83 31.85,21.75 31.39,21.75 U1.37 | v26.82,13.06 26.21,12.45 23.01,12.45 20.42,9.86 J1.3
  Bottom 0.254: v32.77,20.83 32.77,16.11 29.72,13.06 v26.82,13.06
SCL  (via drill 0.38)
  Top 0.254: 44.81,39.43 45.87,39.43 U$3.4 | 44.81,39.43 44.81,38.21 44.96,38.05 v46.02,38.05 | v54.1,37.9 55.63,37.9 U$6.12 | v24.69,16.57 24.99,16.26 26.37,16.26 27.13,17.02 27.13,18.85 U1.25 | v22.86,30.13 v21.64,28.91 | v43.59,39.12 43.89,39.43 44.81,39.43
  Bottom 0.254: v46.02,38.05 46.33,38.36 53.65,38.36 v54.1,37.9 | v24.69,16.57 21.34,16.57 20.27,17.63 20.27,27.08 21.64,28.45 v21.64,28.91 | v22.86,30.13 23.32,30.13 24.69,31.5 33.22,31.5 33.98,32.26 37.03,32.26 43.59,38.82 v43.59,39.12
SDA  (via drill 0.38)
  Top 0.254: v34.59,19.61 33.83,18.85 33.38,18.85 31.09,16.57 28.8,16.57 27.58,17.79 27.58,18.85 U1.26 | v46.02,36.99 46.79,37.75 46.79,38.36 U$3.6 | v56.69,37.9 56.24,38.36 55.78,38.36 U$6.11
  Bottom 0.254: v34.59,19.61 33.53,20.68 33.53,26.62 43.89,36.99 v46.02,36.99 54.25,36.99 55.17,37.9 v56.69,37.9
TX0  (via drill 0.61)
  Top 0.254: v32.52,35.28 32.52,27.51 31.76,26.74 31.46,26.74 U1.47
  Bottom 0.254: v32.52,35.28 33.44,35.28 36.18,38.02 JP9.RXI
TX1  (via drill 0.38)
  Top 0.254: v29.26,17.79 28.65,18.39 28.65,18.85 U1.28 | v32,16.41 33.83,16.41 v34.59,15.65
  Bottom 0.254: v29.26,17.79 30.63,17.79 v32,16.41 | v34.59,15.65 34.29,15.65 33.53,14.89 33.53,14.28 39.78,8.03 49.38,8.03 50.6,9.25 JP4.1
VCC
  Top 0.254: 62.48,28.15 66.29,28.15 66.45,28.3 C23.1 | 62.48,28.15 61.87,28.15 U$1.3 | 62.48,50.04 62.48,33.94 | 62.48,33.94 62.48,28.15 | 52.27,3.84 52.27,18.39 52.73,18.85 53.34,18.85 60.5,26.02 61.72,26.02 U$1.1 | 62.48,33.94 67.67,33.94 68.43,33.18 68.43,16.72 67.06,15.35 JP3.2
  Top 1.016: 67.15,14.54 JP3.2 66.7,14.76 66.7,13.04 62.69,9.03 U3.9 59.24,8.49 D6.C | K3.1 63.07,1.97 D6.C | K1.1 2.92,47.94 D4.C 10.66,49.34 28.4,49.34 29.4,48.34 D5.C 54.5,48.34 56.2,50.04 62.48,50.04 66.11,50.04 K2.1 | D7.C 15.45,3.84 52.27,3.84 52.6,3.84 54.56,5.8 D6.C
  Bottom 1.016: K4.1 9.7,3.19 D7.C
VDD
  Top 0.254: C10.1 50.66,31.16 49.74,30.25 44.87,30.25 R2.2 44.72,30.1 43.65,29.03 43.65,27.66 48.37,22.93 49.44,22.93 53.86,27.35 JP1.1 53.86,27.51 55.23,26.13 59.19,26.13 U$1.5